# EAGLE design V1 (EAGLE 8.7.0)
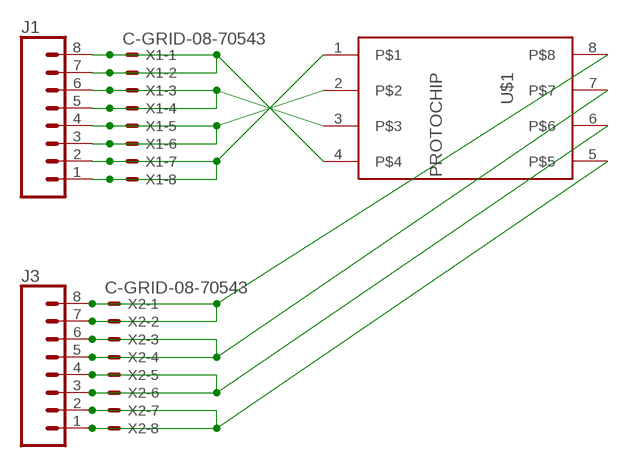
[diagram p0: schematic, sheet 1]

## Parts
J1  CONN_08SMD-COMBO-FEMALE  [1X08_SMD_COMBINED]
J3  CONN_08SMD-COMBO-FEMALE  [1X08_SMD_COMBINED]
U$1  PROTOCHIP  [PROTOCHIP]
X1  C-GRID-08-70543  [70543-08]
X2  C-GRID-08-70543  [70543-08]

## Nets
N$2: J1.7 J1.8 U$1.4 X1.1 X1.2
N$4: J1.5 J1.6 U$1.3 X1.3 X1.4
N$6: J1.3 J1.4 U$1.2 X1.5 X1.6
N$8: J1.1 J1.2 U$1.1 X1.7 X1.8
N$10: J3.7 J3.8 U$1.8 X2.1 X2.2
N$12: J3.5 J3.6 U$1.7 X2.3 X2.4
N$14: J3.3 J3.4 U$1.6 X2.5 X2.6
N$16: J3.1 J3.2 U$1.5 X2.7 X2.8

## Library data of the parts
J1 J3 = SparkFun-Connectors:CONN_08: Multi connection point. Often used as Generic Header-pin footprint for 0.1 inch spaced/style header connections On any of the 0.1 inch spaced packages, you can populate with these: Break Away Headers - Straight <https://www.sparkfun.com/products/116> (PRT-00116) Break Away Male Headers - Right Angle <https://www.sparkfun.com/products/553> (PRT-00553) Female Headers <https://www.sparkfun.com/products/115> (PRT-00115) Break Away Headers - Machine Pin <https://www.sparkfun.com/products/117> (PRT-00117) Break Away Female Headers - Swiss Machine Pin <https://www.sparkfun.com/products/743> (PRT-00743) Arduino Stackable Header - 8 Pin <https://www.sparkfun.com/products/9279> (PRT-09279) For SCREWTERMINALS and SPRING TERMINALS visit here: Screw Terimnals on SparkFun.com <https://www.sparkfun.com/search/results?term=Screw+Terminals> (5mm/3.5mm/2.54mm spacing) This device is also useful as a general connection point to wire up your design to another part of your project. Our various solder wires solder well into these plated through hole pads. Hook-Up Wire - Assortment (Stranded, 22 AWG) <https://www.sparkfun.com/products/11375> (PRT-11375) Hook-Up Wire - Assortment (Solid Core, 22 AWG) <https://www.sparkfun.com/products/11367> (PRT-11367) View the entire wire category on our website here <https://www.sparkfun.com/categories/141> Special notes: Molex polarized connector foot print use with SKU : PRT-08231 with associated crimp pins and housings. 1MM SMD Version SKU: PRT-10208 NOTES ON THE VARIANTS LOCK and LOCK_LONGPADS... This footprint was designed to help hold the alignment of a through-hole component (i.e. 6-pin header) while soldering it into place. You may notice that each hole has been shifted either up or down by 0.005 of an inch from it's more standard position (which is a perfectly straight line). This slight alteration caused the pins (the squares in the middle) to touch the edges of the holes. Because they are alternating, it causes a "brace" to hold the component in place. 0.005 has proven to be the perfect amount of "off-center" position when using our standard breakaway headers. Although looks a little odd when you look at the bare footprint, once you have a header in there, the alteration is very hard to notice. Also,if you push a header all the way into place, it is covered up entirely on the bottom side.; PROD_ID: CONN-10204; SF_ID: PRT-11543
U$1 = mylibrary:PROTOCHIP
X1 X2 = con-molex:C-GRID-08: CONNECTOR wire to board 2.54 mm (0.100") pitch header; MF: MOLEX; OC_FARNELL: unknown; OC_NEWARK: unknown

## Board
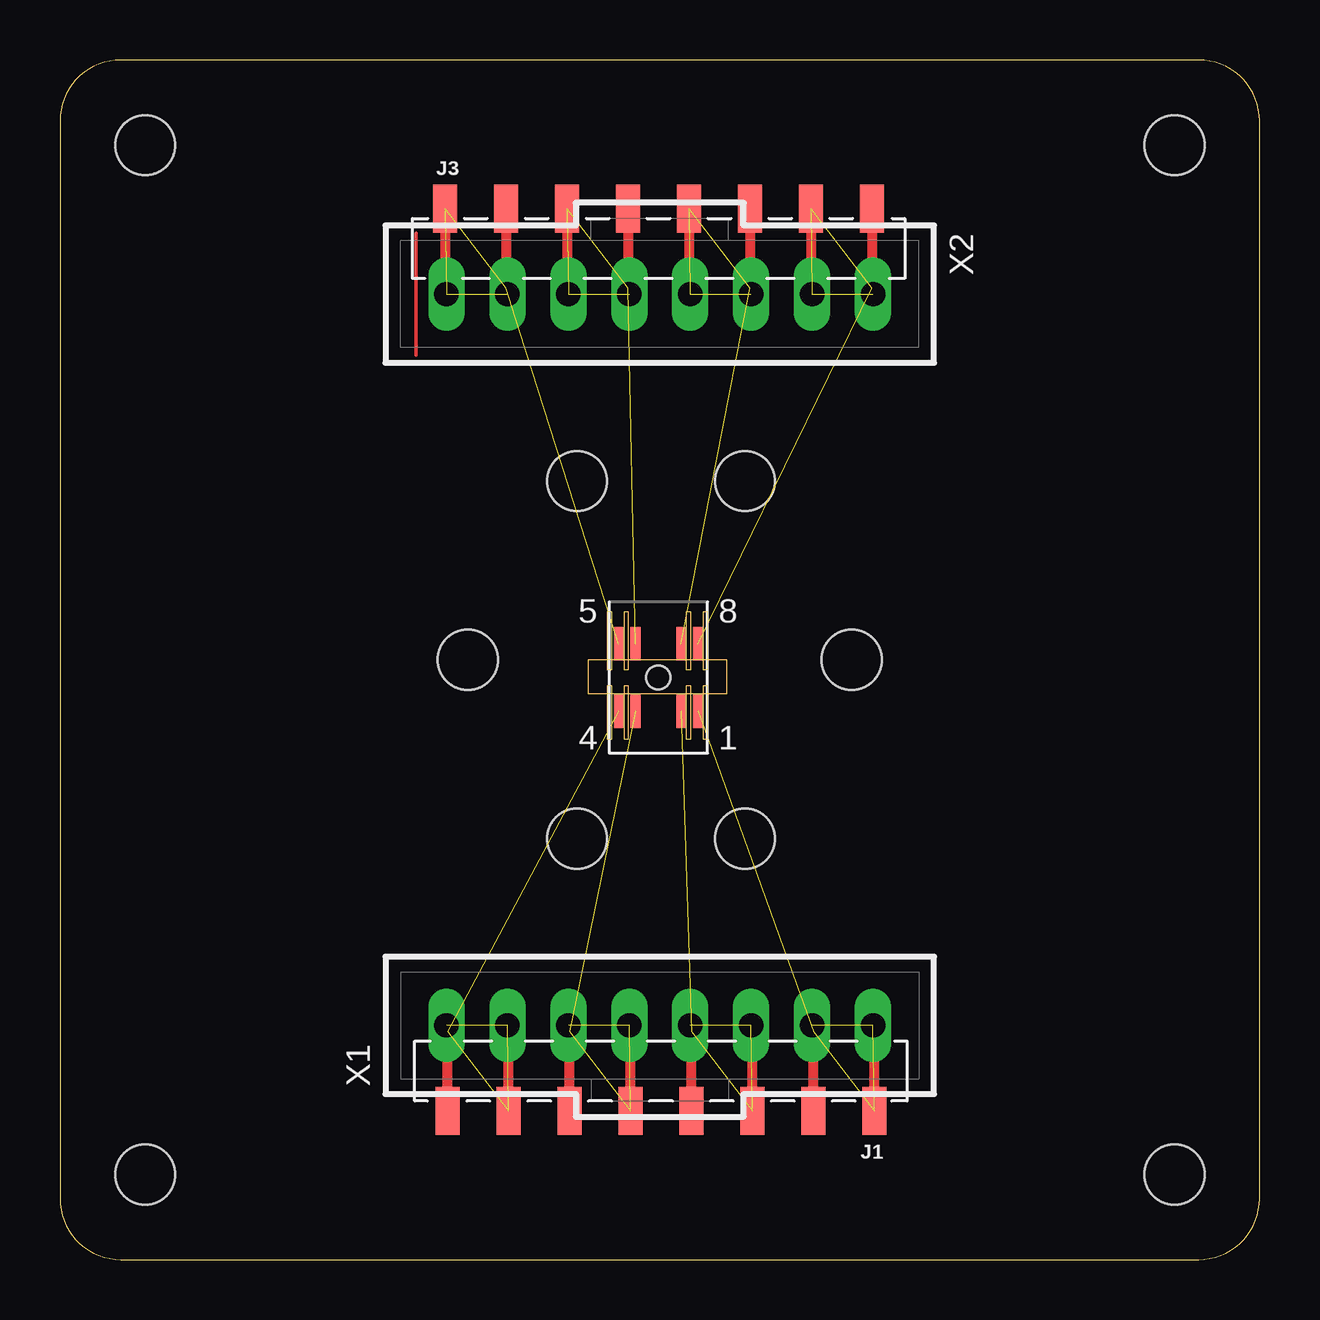
[diagram p1: board, top side]

Size 50 x 50 mm. Coordinates in mm from the lower left corner, seen from the top.
Outline: 0,47.46 0,2.54 arc90 2.54,0 47.46,0 arc90 50,2.54 50,47.46 arc90 47.46,50 2.54,50 arc90 0,47.46
Copper layers (1*16): Top 0.035mm / dielectric 1.5mm / Bottom 0.035mm
Design rules "default": minimum track width 6mil, minimum drill 0.35mm, track to track 6mil, track to pad 6mil, pad to pad 6mil, via to via 6mil, smd to smd 6mil, copper to edge 40mil, drill to drill 6mil, minimum pad ring 10mil, minimum via ring 8mil, stop-mask expansion 4mil, vias tented up to drill 0mil, thermal gap 10mil
Holes 2.5 mm at 3.55,46.45 46.45,46.45 46.45,3.55 3.55,3.55 17,25 33,25 28.55,32.45 21.55,32.45 28.55,17.55 21.55,17.55
Milling: area 23.5,21.7 to 23.7,23.9; area 26.1,21.7 to 26.3,23.9; area 23.5,24.6 to 23.7,27; area 26.1,24.6 to 26.3,27; area 22.8,24.6 to 23,27; area 26.8,24.6 to 27,27; area 22.8,21.7 to 23,23.9; area 26.8,21.7 to 27,23.9; area 22,23.6 to 27.8,25

### Footprints (pad centres in the part's own frame; a part is rotated, then mirrored left to right if it is on the bottom)
1X08_SMD_COMBINED = smd 1 x 2: 1 0,1.65; 1@2 0,-1.65; 2 2.54,-1.65; 2@2 2.54,1.65; 3 5.08,1.65; 3@2 5.08,-1.65; 4 7.62,-1.65; 4@2 7.62,1.65; 5 10.16,1.65; 5@2 10.16,-1.65; 6 12.7,-1.65; 6@2 12.7,1.65; 7 15.24,1.65; 7@2 15.24,-1.65; 8 17.78,-1.65; 8@2 17.78,1.65
PROTOCHIP = smd 0.4 x 1.4: 1 1.65,-1.4; 2 0.95,-1.4; 3 -0.95,-1.4; 4 -1.65,-1.4; 5 -1.65,1.4; 6 -0.95,1.4; 7 0.95,1.4; 8 1.65,1.4 | hole 1: 0,0
70543-08 = drill 1.016 long: 1 -8.89,0; 2 -6.35,0; 3 -3.81,0; 4 -1.27,0; 5 1.27,0; 6 3.81,0; 7 6.35,0; 8 8.89,0

### Placement (x,y rotation side)
J1  33.94,7.86 180 top
J3  16.06,42.14 0 top
U$1  24.94,24.26 0 top
X1  25,9.76 0 top
X2  25,40.24 180 top

### Tracks (layer width: path | path; a pad name or v marks a point on that pad's centre or on a via)
N$1
  Top 0.152: 14.84,37.7 14.84,42.78
N$2  (4 unrouted)
N$4  (4 unrouted)
N$6  (4 unrouted)
N$8  (4 unrouted)
N$10  (4 unrouted)
N$12  (4 unrouted)
N$14  (4 unrouted)
N$16  (4 unrouted)